# Altium schematic sheet Water_SmartSchematicV1.SchDoc
size A; SheetNumber: 2; SheetTotal: 2
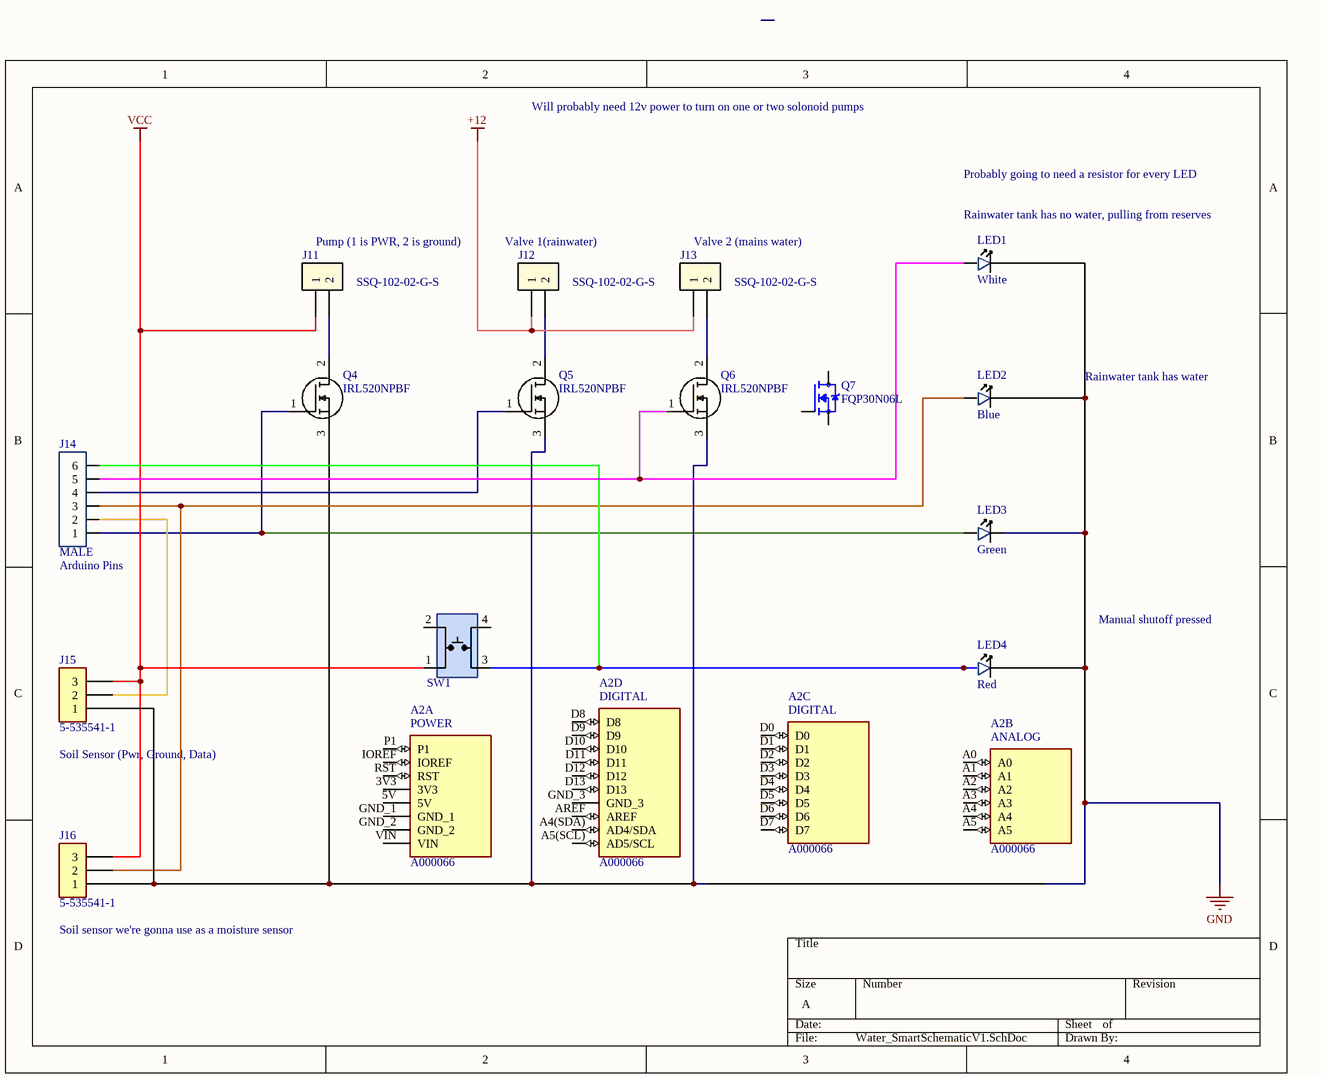
[diagram p0: Water_SmartSchematicV1.SchDoc]

## Parts
A2  A000066  [ARDUINO_A000066]  (parts A,B,C,D of 4)
J11  SSQ-102-02-G-S  [JF-2_1X2_TU_SSQ]
J12  SSQ-102-02-G-S  [JF-2_1X2_TU_SSQ]
J13  SSQ-102-02-G-S  [JF-2_1X2_TU_SSQ]
J14  MALE  [6_PIN_100MIL-Male]
J15  5-535541-1  [JF_TE_5-535541-1]
J16  5-535541-1  [JF_TE_5-535541-1]
LED1  White  [LED_1206]
LED2  Blue  [LED_1206]
LED3  Green  [LED_1206]
LED4  Red  [LED_1206]
Q4  IRL520NPBF  [TO254P469X1042X1967-3P]
Q5  IRL520NPBF  [TO254P469X1042X1967-3P]
Q6  IRL520NPBF  [TO254P469X1042X1967-3P]
Q7  FQP30N06L  [TO220V]
SW1  TL3305AF160QG  [Switch_JLC]  (value not drawn)

## Nets
+12: J12.1 J13.1
GND: J15.1 J16.1 LED1.2 LED2.2 LED3.2 LED4.2 Q4.3(S) Q5.3(S) Q6.3(S)
VCC: J11.1 J15.3 J16.3 SW1.1
NetJ11_2: J11.2 Q4.2(D)
NetJ12_2: J12.2 Q5.2(D)
NetJ13_2: J13.2 Q6.2(D)
NetJ14_1: J14.1 LED3.1 Q4.1(G)
NetJ14_2: J14.2 J15.2
NetJ14_3: J14.3 J16.2 LED2.1
NetJ14_4: J14.4 Q5.1(G)
NetJ14_5: J14.5 LED1.1 Q6.1(G)
NetJ14_6: J14.6 LED4.1 SW1.3

Not connected (* = marked no-connect by the designer): A2 3V3 5V A0 A1 A2 A3 A4 A4(SDA)(AD4/SDA) A5 A5(SCL)(AD5/SCL) AREF D0 D1 D2 D3 D4 D5 D6 D7 D8 D9 D10 D11 D12 D13 GND_1 GND_2 GND_3 IOREF P1 RST VIN; Q7 1(G) 2(D) 3(S); SW1 2 4

## Notes on the sheet
- Will probably need 12v power to turn on one or two solonoid pumps
- Probably going to need a resistor for every LED
- (near LED1) Rainwater tank has no water, pulling from reserves
- Pump (1 is PWR, 2 is ground)
- (near J12) Valve 1(rainwater)
- (near J13) Valve 2 (mains water)
- Rainwater tank has water
- (near J14) Arduino Pins
- Manual shutoff pressed
- (near J15) Soil Sensor (Pwr, Ground, Data)
- (near J16) Soil sensor we're gonna use as a moisture sensor
- (in symbol A000066, part A) POWER
- (in symbol A000066, part B) ANALOG
- (in symbol A000066, part C) DIGITAL
- (in symbol A000066, part D) DIGITAL

## Library data of the parts
A2 = A000066: Microcontroller board based on the ATmega328P.; pin to pad: A4(SDA)>A4(SDA; MF: Arduino; MP: Arduino Uno Rev3; Value: *; SnapEDA_Link: https://www.snapeda.com/parts/Arduino%20Uno%20Rev3/Arduino/view-part/?ref=snap; Availability: Not in stock; Price: None; Package: Non-Standard Arduino; Check_prices: https://www.snapeda.com/parts/Arduino%20Uno%20Rev3/Arduino/view-part/?ref=eda
J11-J13 = JF_2_PIN_FEMALE: 2.54mm Straight 1x2P 2 1 Straight,P=2.54mm  Female Headers ROHSon Available; MFR PART #: C49661; MFR PN: SSQ-102-02-G-S; LCSC PART#: C49661
J14 = JM_6_PIN_MALE: Male header- 6 pin 1 row- through Hole; LCSC Part#: C37208; Datasheet: https://datasheet.lcsc.com/szlcsc/1810312320_BOOMELE-Boom-Precision-Elec-C37208_C37208.pdf; Type: Extended; Value: MALE
J15 J16 = JF_3_PIN_FEMALE: Conn Socket Strip RCP 3 POS 2.54mm Solder ST Thru-Hole; MFR PART #: PM2.54-1*3; MP: 5-535541-1; LCSC PART#: C5116529
LED1 = LED_WHITE_1206: White light 1206  Light Emitting Diodes (LED) ROHS; MFR Part #: NCD1206W1; Type: Extended; LCSC Part#: C130718; Datasheet: https://datasheet.lcsc.com/lcsc/2008201033_Foshan-NationStar-Optoelectronics-NCD1206W1_C130718.pdf; Value: White
LED2 = LED_BLUE_1206: blue 1206  Light Emitting Diodes (LED) ROHS; MFR Part #: NCD1206B1; Type: Extended; LCSC Part#: C130717; Datasheet: https://datasheet.lcsc.com/lcsc/2008201033_Foshan-NationStar-Optoelectronics-NCD1206B1_C130717.pdf; Value: Blue
LED3 = LED_GREEN_1206: Green 513~528nm 1206 Light Emitting Diodes (LED) RoHS; MFR Part #: SZYY1206G; Type: Extended; LCSC Part#: C434439; Datasheet: https://datasheet.lcsc.com/lcsc/2006301532_Yongyu-Photoelectric-SZYY1206G_C434439.pdf; Value: Green
LED4 = LED_RED_1206: Red 621~631nm 1206 Light Emitting Diodes (LED) RoHS; MFR Part #: 15-21/R6C-FQ1R1B/2T; Type: Extended; LCSC Part#: C93133; Datasheet: https://datasheet.lcsc.com/szlcsc/1811151241_Everlight-Elec-15-21-R6C-FQ1R1B-2T_C93133.pdf; Value: Red
Q4-Q6 = Q_Nch_MOSFET_PTH: MOSFET (N-Channel)  IRL520NPBF; Manufacturer_Name: Infineon; Datasheet Link: https://www.infineon.com/dgdl/irl520npbf.pdf?fileId=5546d462533600a40153565f9b62255b; Height: 4.69mm; Manufacturer_Part_Number: IRL520NPBF; Mouser Part Number: 942-IRL520NPBF; Mouser Price/Stock: https://www.mouser.co.uk/ProductDetail/Infineon-IR/IRL520NPBF?qs=9%252BKlkBgLFf3eZ5ppEpIaKQ%3D%3D; Arrow Part Number: IRL520NPBF; Arrow Price/Stock: https://www.arrow.com/en/products/irl520npbf/infineon-technologies-ag?region=nac
Q7 = FQP30N06L: N-Channel 60V 32A _Tc_ 79W _Tc_ Through Hole TO-220-3; MF: ON Semiconductor; Package: TO-220 ON Semiconductor; Price: None; Availability: Unavailable; MP: FQP30N06L; SnapEDA_Link: https://www.snapeda.com/parts/FQP30N06L/ON%20Semiconductor/view-part/1413126/?ref=snap; Value: *
SW1 = SW_Push_Button_JLC: Tactile Switch SPST-NO Top Actuated Surface Mount; MFR Part #: KH-4.5X4.5X4.3H-STM; LCSC Part#: C2837550; Type: Extended; DataSheet: https://datasheet.lcsc.com/lcsc/2106081532_Shenzhen-Kinghelm-Elec-KH-4.5X4.5X4.3H-STM_C2837550.pdf